# Altium project Arduino_clock.PrjPcb
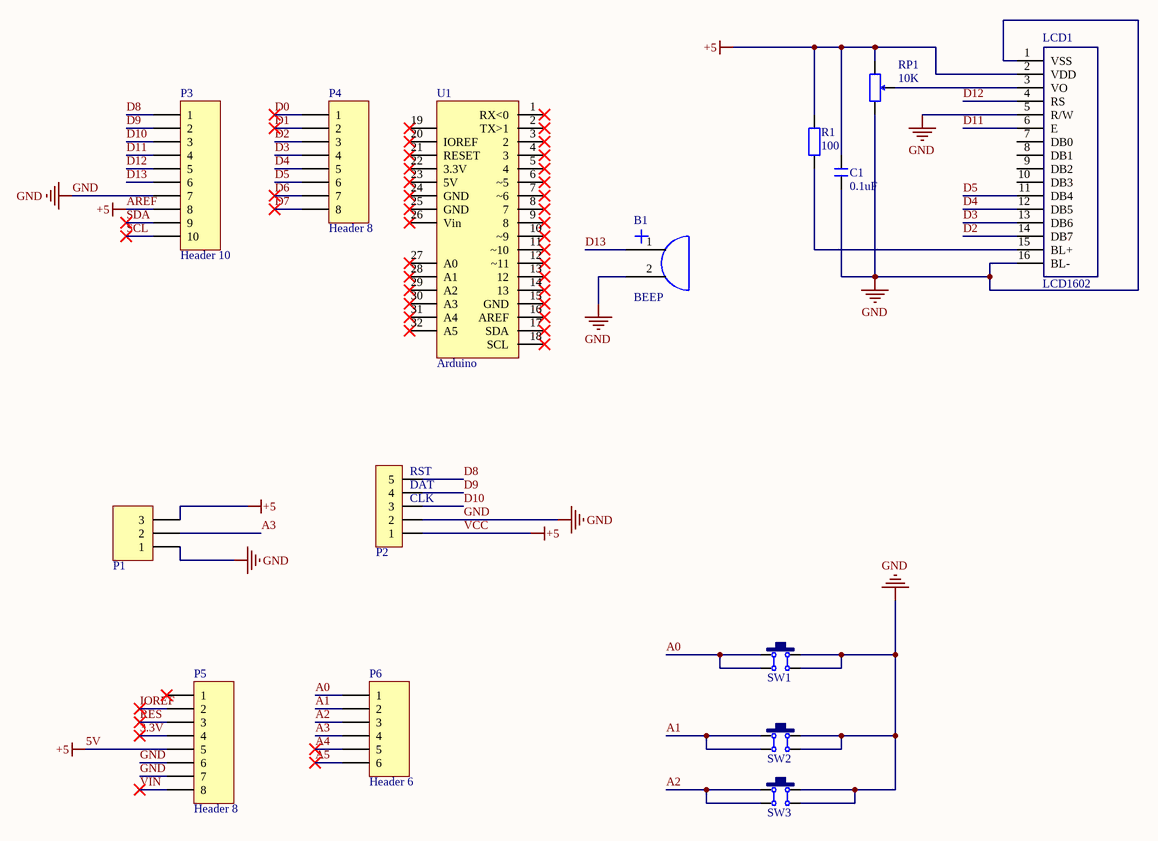
[diagram p0: Arduino_clock.SchDoc]
1 sheet, 15 parts. Net scope: global (net labels, ports and power ports of the same name join across sheets).
Board file: Arduino_clokc.PcbDoc

## Sheet Arduino_clock.SchDoc
size A4; SheetNumber: 1; SheetTotal: 1

### Parts
B1  BEEP  [Beep]
C1  0.1uF  [CY 5*7*2.5]
LCD1  LCD1602  [1602-1]
P1  Header 3  [HDR2.54-LI-3P]  (value not drawn)
P2  HDR-1X5  [HDR2.54-LI-5P]  (value not drawn)
P3  Header 10  [HDR2.54-LI-10P]
P4  Header 8  [HDR2.54-LI-8P]
P5  Header 8  [HDR2.54-LI-8P]
P6  Header 6  [HDR2.54-LI-6P]
R1  100  [AXIAL0.4-1/4W]
RP1  10K  [RM065]
SW1  6x6x5  [TSW DIP-6*6*6]  (value not drawn)
SW2  6x6x5  [TSW DIP-6*6*6]  (value not drawn)
SW3  6x6x5  [TSW DIP-6*6*6]  (value not drawn)
U1  Arduino  [Arduino-UNO]

### Nets
5V: C1.2 LCD1.2(VDD) P1.3 P2.1 P3.8 P5.5 R1.2 RP1.1  [also labelled +5, AREF, VCC]
GND: B1.2 C1.1 LCD1.1(VSS) LCD1.5(R/W) LCD1.16(BL-) P1.1 P2.2 P3.7 P5.6 P5.7 RP1.3 SW1.2 SW1.3 SW2.2 SW2.3 SW3.2 SW3.3
3.3V: P5.4
A0: P6.1 SW1.1 SW1.4
A1: P6.2 SW2.1 SW2.4
A2: P6.3 SW3.1 SW3.4
A3: P1.2 P6.4
A4: P6.5
A5: P6.6
D0: P4.1
D1: P4.2
D2: LCD1.14(DB7) P4.3
D3: LCD1.13(DB6) P4.4
D4: LCD1.12(DB5) P4.5
D5: LCD1.11(DB4) P4.6
D6: P4.7
D7: P4.8
D8: P2.5 P3.1
D9: P2.4 P3.2
D10: P2.3 P3.3
D11: LCD1.6(E) P3.4
D12: LCD1.4(RS) P3.5
D13: B1.1 P3.6
IOREF: P5.2
RES: P5.3
SCL: P3.10
SDA: P3.9
VIN: P5.8
NetLCD1_3: LCD1.3(VO) RP1.2
NetLCD1_15: LCD1.15(BL+) R1.1

Not connected (* = marked no-connect by the designer): LCD1 7(DB0) 8(DB1) 9(DB2) 10(DB3); P5 1*; U1 1(RX<0)* 2(TX>1)* 3(2)* 4(3)* 5(4)* 6(~5)* 7(~6)* 8(7)* 9(8)* 10(~9)* 11(~10)* 12(~11)* 13(12)* 14(13)* 15(GND)* 16(AREF)* 17(SDA)* 18(SCL)* 19* 20(IOREF)* 21(RESET)* 22(3.3V)* 23(5V)* 24(GND)* 25(GND)* 26(Vin)* 27(A0)* 28(A1)* 29(A2)* 30(A3)* 31(A4)* 32(A5)*

### Notes on the sheet
- (near P2) RST
- (near P2) DAT
- (near P2) CLK

### Library data of the parts
B1 = BEEP: 蜂鸣器
C1 = C-CY: 高压陶瓷电容，Y电容; 版权归属: 源创客; BOM名称: 高压陶瓷电容，Y电容; 学习资源: www.ooocke.com
P1 = Header 3: 接插件; LatestRevisionDate: 17-Jul-2002; LatestRevisionNote: Re-released for DXP Platform.; Publisher: Altium Limited
P2 = Header 5: 5P接插件; 版权归属: 源创客; BOM名称: 5P接插件; 学习资源: www.ooocke.com
P3 = Header 10: Header, 10-Pin; LatestRevisionDate: 17-Jul-2002; LatestRevisionNote: Re-released for DXP Platform.; Publisher: Altium Limited
P4 P5 = Header 8: Header, 8-Pin; LatestRevisionDate: 17-Jul-2002; LatestRevisionNote: Re-released for DXP Platform.; Publisher: Altium Limited
P6 = Header 6: 接插件; LatestRevisionDate: 17-Jul-2002; LatestRevisionNote: Re-released for DXP Platform.; Publisher: Altium Limited
R1 = R: 贴片电阻; 版权归属: 源创客; BOM名称: 贴片电阻; 学习资源: www.ooocke.com
RP1 = RP-ID: 插件单联电位器; BOM名称: 插件电位器; 版权归属: 源创客; 学习资源: www.ooocke.com
SW1-SW3 = TSW DIP-6x6: 直插6x6轻触开关; 版权归属: 源创客; BOM名称: 直插6x6轻触开关; 学习资源: www.ooocke.com
U1 = Arduino-UNO